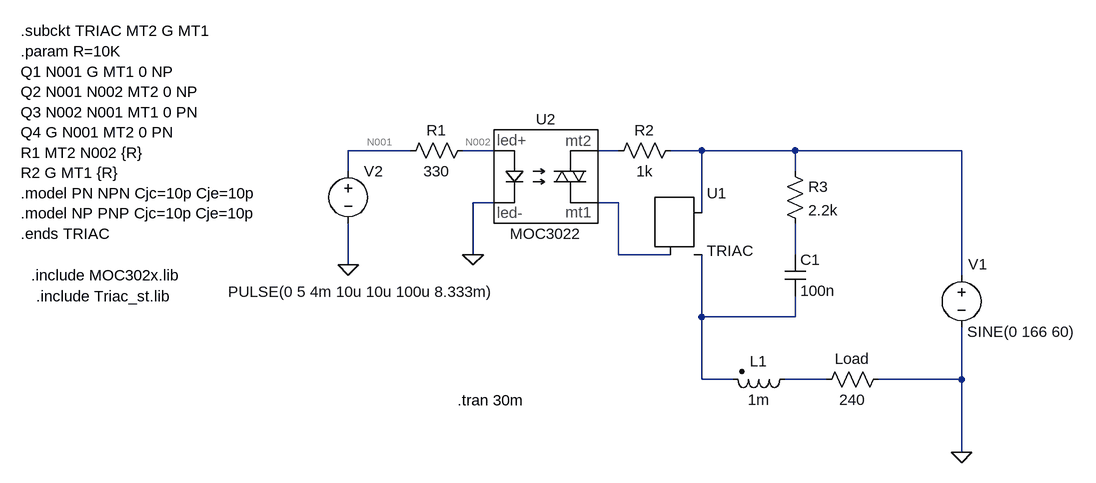
[diagram p0: schematic dimmer.asc]
dimmer.asc, the LTspice schematic file:
Version 4
SHEET 1 1636 680
WIRE -208 -64 -304 -64
WIRE -80 -64 -128 -64
WIRE 112 -64 80 -64
WIRE 240 -64 192 -64
WIRE 384 -64 240 -64
WIRE 640 -64 384 -64
WIRE -304 -32 -304 -64
WIRE 384 -32 384 -64
WIRE -80 16 -112 16
WIRE 112 16 80 16
WIRE 240 32 240 -64
WIRE -112 96 -112 16
WIRE 112 96 112 16
WIRE 192 96 112 96
WIRE 384 96 384 48
WIRE -304 112 -304 48
WIRE 640 128 640 -64
WIRE 240 192 240 96
WIRE 384 192 384 160
WIRE 384 192 240 192
WIRE 240 288 240 192
WIRE 288 288 240 288
WIRE 432 288 368 288
WIRE 640 288 640 208
WIRE 640 288 512 288
WIRE 640 400 640 288
FLAG 640 400 0
FLAG -304 112 0
FLAG -112 96 0
SYMBOL voltage 640 112 R0
WINDOW 0 10 -1 Left 0
WINDOW 3 9 103 Left 0
WINDOW 123 0 0 Left 0
WINDOW 39 0 0 Left 0
SYMATTR InstName V1
SYMATTR Value SINE(0 166 60)
SYMBOL res 528 272 R90
WINDOW 0 0 56 VBottom 0
WINDOW 3 32 56 VTop 0
SYMATTR InstName Load
SYMATTR Value 240
SYMBOL voltage -304 -48 R0
WINDOW 3 -185 201 Left 0
WINDOW 123 0 0 Left 0
WINDOW 39 0 0 Left 0
SYMATTR Value PULSE(0 5 4m 10u 10u 100u 8.333m)
SYMATTR InstName V2
SYMBOL LED_TRIAC -32 -48 R0
SYMATTR InstName U2
SYMATTR SpiceModel MOC3022
SYMBOL res -112 -80 R90
WINDOW 0 0 56 VBottom 0
WINDOW 3 32 56 VTop 0
SYMATTR InstName R1
SYMATTR Value 330
SYMBOL res 208 -80 R90
WINDOW 0 0 56 VBottom 0
WINDOW 3 32 56 VTop 0
SYMATTR InstName R2
SYMATTR Value 1k
SYMBOL Misc\\TRIAC 208 32 R0
SYMATTR InstName U1
SYMBOL ind2 384 272 R90
WINDOW 0 4 56 VBottom 0
WINDOW 3 32 56 VTop 0
SYMATTR InstName L1
SYMATTR Value 1m
SYMATTR Type ind
SYMBOL res 368 -48 R0
SYMATTR InstName R3
SYMATTR Value 2.2k
SYMBOL cap 368 96 R0
SYMATTR InstName C1
SYMATTR Value 100n
TEXT -136 320 Left 0 !.tran 30m
TEXT -808 -248 Left 0 !.subckt TRIAC MT2 G MT1\n.param R=10K\nQ1 N001 G MT1 0 NP\nQ2 N001 N002 MT2 0 NP\nQ3 N002 N001 MT1 0 PN\nQ4 G N001 MT2 0 PN\nR1 MT2 N002 {R}\nR2 G MT1 {R}\n.model PN NPN Cjc=10p Cje=10p\n.model NP PNP Cjc=10p Cje=10p\n.ends TRIAC
TEXT -792 128 Left 0 !.include MOC302x.lib
TEXT -784 160 Left 0 !.include Triac_st.lib

The netlist it stands for:
* dimmer.asc
V1 N004 0 SINE(0 166 60)
R§Load 0 N008 240
V2 N001 0 PULSE(0 5 4m 10u 10u 100u 8.333m)
XU2 N002 0 N003 N005 MOC3022  ; pins led+ led- mt2 mt1
R1 N002 N001 330
R2 N004 N003 1k
XU1 N004 N005 N007 TRIAC  ; pins MT2 G MT1
L1 N008 N007 1m
R3 N004 N006 2.2k
C1 N006 N007 100n
.tran 30m
.subckt TRIAC MT2 G MT1
.param R=10K
Q1 N001 G MT1 0 NP
Q2 N001 N002 MT2 0 NP
Q3 N002 N001 MT1 0 PN
Q4 G N001 MT2 0 PN
R1 MT2 N002 {R}
R2 G MT1 {R}
.model PN NPN Cjc=10p Cje=10p
.model NP PNP Cjc=10p Cje=10p
.ends TRIAC
.include MOC302x.lib
.include Triac_st.lib
.backanno
.end